# EAGLE design SilovaCastV2 (EAGLE 7.2.0)
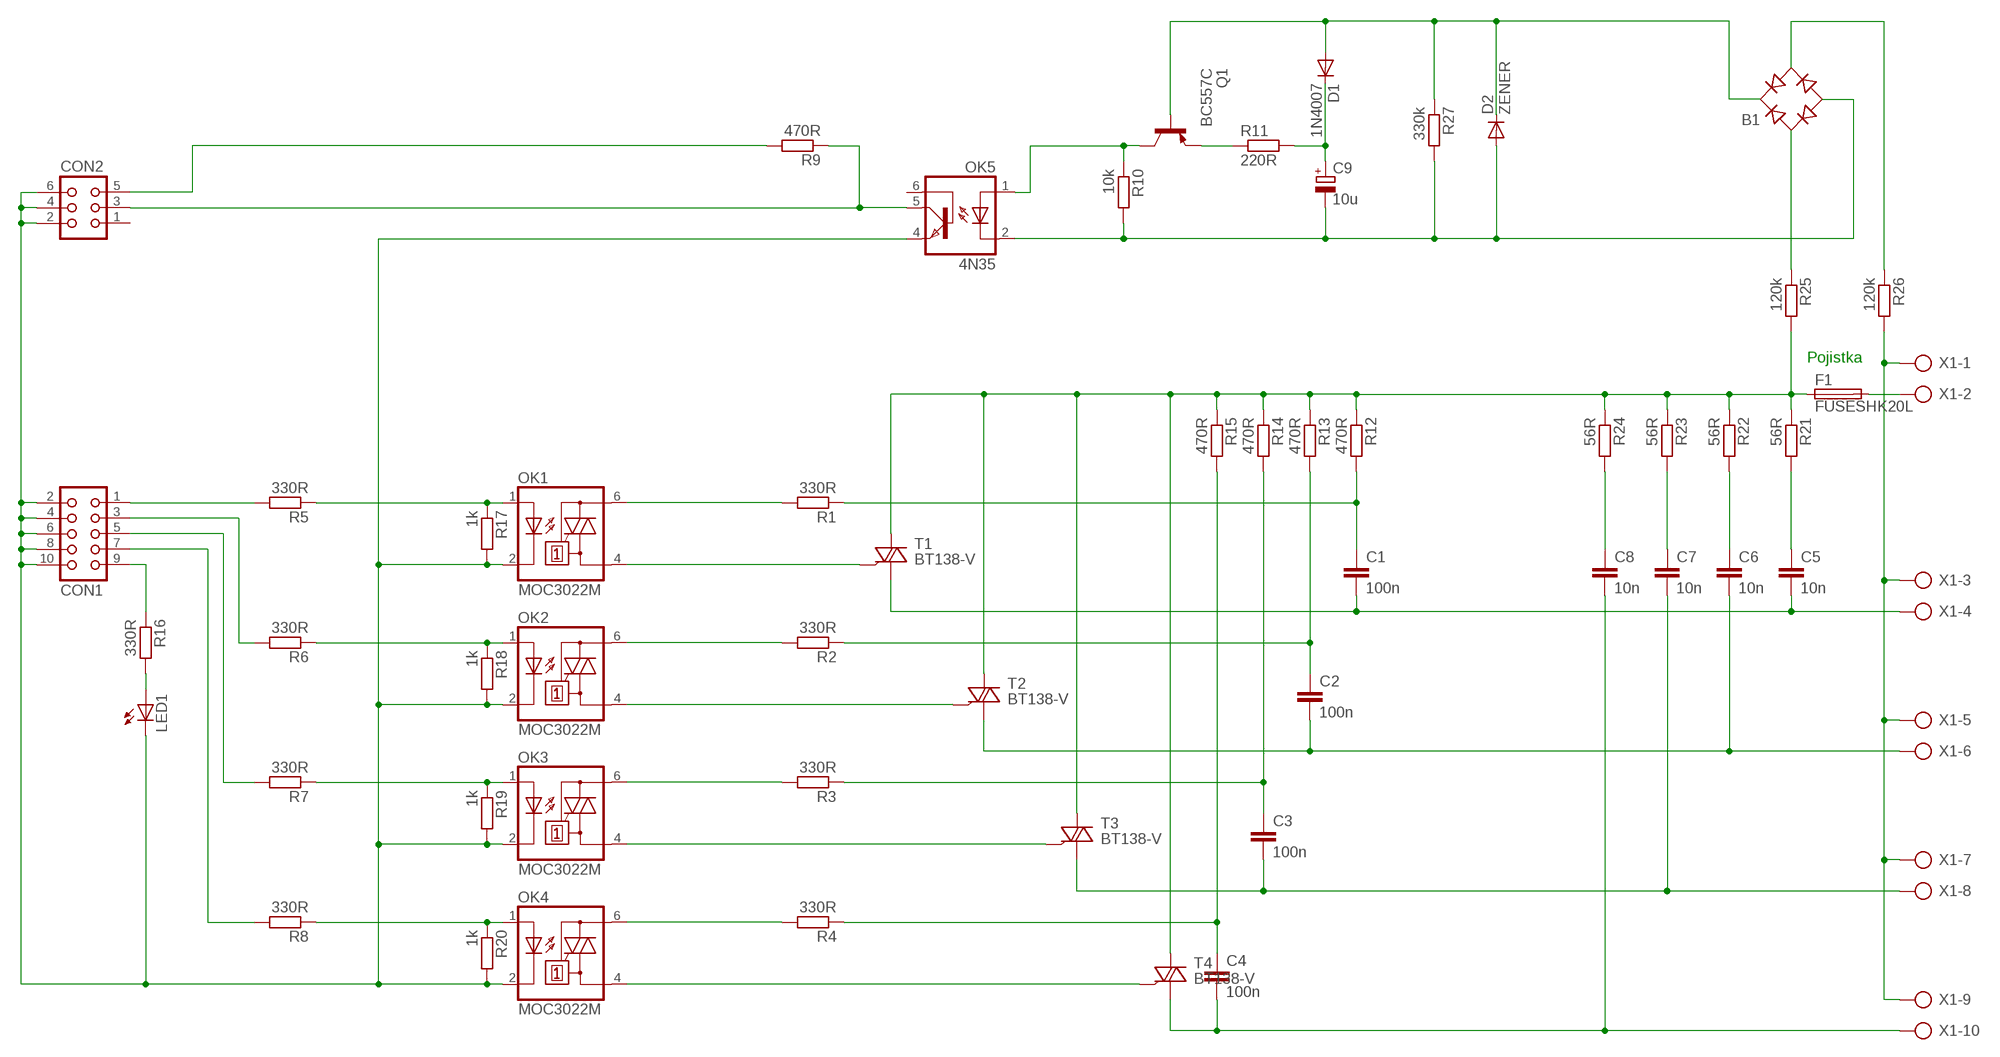
[diagram p0: schematic, sheet 1]

## Parts
B1  RB1A  [RB1A]
C1  100n  C7.5/6  [C7.5B6]
C2  100n  C7.5/6  [C7.5B6]
C3  100n  C7.5/6  [C7.5B6]
C4  100n  C7.5/6  [C7.5B6]
C5  10n  C7.5/6  [C7.5B6]
C6  10n  C7.5/6  [C7.5B6]
C7  10n  C7.5/6  [C7.5B6]
C8  10n  C7.5/6  [C7.5B6]
C9  10u  CPOL-EUE3.5-8  [E3,5-8]
CON1  CON10  [CON10]
CON2  CON06  [CON06]
D1  1N4007  1N4004  [DO41-10]
D2  ZENER  1N4004  [DO41-10]
F1  FUSESHK20L  [SHK20L]
LED1  LED5MM  [LED5MM]
OK1  MOC3022M  [DIL06]
OK2  MOC3022M  [DIL06]
OK3  MOC3022M  [DIL06]
OK4  MOC3022M  [DIL06]
OK5  4N35  [DIL06]
Q1  BC557C  [TO92-EBC]
R1  330R  R-EU_0207/12  [0207/12]
R2  330R  R-EU_0207/12  [0207/12]
R3  330R  R-EU_0207/12  [0207/12]
R4  330R  R-EU_0207/12  [0207/12]
R5  330R  R-EU_R0805  [R0805]
R6  330R  R-EU_R0805  [R0805]
R7  330R  R-EU_R0805  [R0805]
R8  330R  R-EU_R0805  [R0805]
R9  470R  R-EU_0207/12  [0207/12]
R10  10k  R-EU_R0805  [R0805]
R11  220R  R-EU_0207/12  [0207/12]
R12  470R  R-EU_0207/12  [0207/12]
R13  470R  R-EU_0207/12  [0207/12]
R14  470R  R-EU_0207/12  [0207/12]
R15  470R  R-EU_0207/12  [0207/12]
R16  330R  R-EU_0207/12  [0207/12]
R17  1k  R-EU_R0805  [R0805]
R18  1k  R-EU_R0805  [R0805]
R19  1k  R-EU_R0805  [R0805]
R20  1k  R-EU_R0805  [R0805]
R21  56R  R-EU_0411/15  [0411/15]
R22  56R  R-EU_0411/15  [0411/15]
R23  56R  R-EU_0411/15  [0411/15]
R24  56R  R-EU_0411/15  [0411/15]
R25  120k  R-EU_0207/12  [0207/12]
R26  120k  R-EU_0207/12  [0207/12]
R27  330k  R-EU_0207/12  [0207/12]
T1  BT138-V  [TO220BV]
T2  BT138-V  [TO220BV]
T3  BT138-V  [TO220BV]
T4  BT138-V  [TO220BV]
X1  AK300/10  [AK300/10]

## Nets
GND: CON1.2 CON1.4 CON1.6 CON1.8 CON1.10 CON2.2 CON2.4 CON2.6 LED1.K(C) OK1.2(C) OK2.2(C) OK3.2(C) OK4.2(C) OK5.4(EMI) R17.2 R18.2 R19.2 R20.2
L: F1.1A R12.1 R13.1 R14.1 R15.1 R21.1 R22.1 R23.1 R24.1 R25.2 T1.T2(A2) T2.T2(A2) T3.T2(A2) T4.T2(A2)
N$1: C3.2 C7.2 T3.T1(A1) X1.8
N$2: C4.2 C8.2 T4.T1(A1) X1.10
N$3: C2.2 C6.2 T2.T1(A1) X1.6
N$4: OK3.4(A1) T3.G
N$5: OK4.4(A1) T4.G
N$6: OK2.4(A1) T2.G
N$7: OK1.4(A1) T1.G
N$8: C1.2 C5.2 T1.T1(A1) X1.4
N$9: OK1.6(A2) R1.2
N$10: OK2.6(A2) R2.2
N$11: OK3.6(A2) R3.2
N$12: OK4.6(A2) R4.2
N$13: C9.+ D1.C R11.2
N$14: B1.+ D1.A D2.C Q1.B R27.1
N$15: B1.- C9.- D2.A OK5.2(C) R10.2 R27.2
N$16: F1.2A X1.2
N$17: CON2.5 R9.2
N$18: OK5.1(A) Q1.C R10.1
N$19: Q1.E R11.1
N$20: C2.1 R2.1 R13.2
N$21: C3.1 R3.1 R14.2
N$22: CON2.3 OK5.5(COL) R9.1
N$23: CON1.1 R5.2
N$24: OK1.1(A) R5.1 R17.1
N$25: OK2.1(A) R6.1 R18.1
N$26: OK3.1(A) R7.1 R19.1
N$27: OK4.1(A) R8.1 R20.1
N$28: CON1.3 R6.2
N$29: CON1.5 R7.2
N$30: CON1.7 R8.2
N$31: CON1.9 R16.1
N$32: C4.1 R4.1 R15.2
N$33: C1.1 R1.1 R12.2
N$34: LED1.A R16.2
N$36: C5.1 R21.2
N$37: C6.1 R22.2
N$38: C7.1 R23.2
N$39: C8.1 R24.2
N$40: B1.AC2 R26.1
N$41: B1.AC1 R25.1
N_PEN: R26.2 X1.1 X1.3 X1.5 X1.7 X1.9
Unconnected: CON2.1 OK5.6(BAS)

## Notes on the sheet
- Pojistka

## Library data of the parts
B1 = rectifier:RB1A: RECTIFIER 1 A
C1-C8 = capacitor-wima:C: CAPACITOR naming: grid - package width
C9 = rcl:CPOL-EU: POLARIZED CAPACITOR, European symbol
CON1 = con-harting:CON10: CONNECTOR; OC_FARNELL: unknown; OC_NEWARK: unknown
CON2 = con-harting:CON06: CONNECTOR; OC_FARNELL: unknown; OC_NEWARK: unknown
D1 D2 = diode:1N4004: DIODE general purpose rectifier, 1 A
F1 = fuse:FUSE: Fuse; OC_FARNELL: unknown; OC_NEWARK: unknown
LED1 = led:LED: LED OSRAM: - CHIPLED LG R971, LG N971, LY N971, LG Q971, LY Q971, LO R971, LY R971 LH N974, LH R974 LS Q976, LO Q976, LY Q976 LO Q996 - Hyper CHIPLED LW Q18S LB Q993, LB Q99A, LB R99A - SideLED LS A670, LO A670, LY A670, LG A670, LP A670 LB A673, LV A673, LT A673, LW A673 LH A674 LY A675 LS A676, LA A676, LO A676, LY A676, LW A676 LS A679, LY A679, LG A679 - Hyper Micro SIDELED® LS Y876, LA Y876, LO Y876, LY Y876 LT Y87S - SmartLED LW L88C, LW L88S LB L89C, LB L89S, LG L890 LS L89K, LO L89K, LY L89K LS L896, LA L896, LO L896, LY L896 - TOPLED LS T670, LO T670, LY T670, LG T670, LP T670 LSG T670, LSP T670, LSY T670, LOP T670, LYG T670 LG T671, LOG T671, LSG T671 LB T673, LV T673, LT T673, LW T673 LH T674 LS T676, LA T676, LO T676, LY T676, LB T676, LH T676, LSB T676, LW T676 LB T67C, LV T67C, LT T67C, LS T67K, LO T67K, LY T67K, LW E67C LS E67B, LA E67B, LO E67B, LY E67B, LB E67C, LV E67C, LT E67C LW T67C LS T679, LY T679, LG T679 LS T770, LO T770, LY T770, LG T770, LP T770 LB T773, LV T773, LT T773, LW T773 LH T774 LS E675, LA E675, LY E675, LS T675 LS T776, LA T776, LO T776, LY T776, LB T776 LHGB T686 LT T68C, LB T68C - Hyper Mini TOPLED® LB M676 - Mini TOPLED Santana® LG M470 LS M47K, LO M47K, LY M47K Source: http://www.osram.convergy.de LUXEON: - LUMILED® LXK2-PW12-R00, LXK2-PW12-S00, LXK2-PW14-U00, LXK2-PW14-V00 LXK2-PM12-R00, LXK2-PM12-S00, LXK2-PM14-U00 LXK2-PE12-Q00, LXK2-PE12-R00, LXK2-PE12-S00, LXK2-PE14-T00, LXK2-PE14-U00 LXK2-PB12-K00, LXK2-PB12-L00, LXK2-PB12-M00, LXK2-PB14-N00, LXK2-PB14-P00, LXK2-PB14-Q00 LXK2-PR12-L00, LXK2-PR12-M00, LXK2-PR14-Q00, LXK2-PR14-R00 LXK2-PD12-Q00, LXK2-PD12-R00, LXK2-PD12-S00 LXK2-PH12-R00, LXK2-PH12-S00 LXK2-PL12-P00, LXK2-PL12-Q00, LXK2-PL12-R00 Source: www.luxeon.com KINGBRIGHT: KA-3528ASYC Source: www.kingbright.com
OK1-OK4 = optocoupler:MOC30*M: RANDOM-PHASE OPTOISOLATORS TRIAC DRIVER OUTPUT Source: http://www.fairchildsemi.com MOC3020-M.pdf; MF: FAIRCHILD SEMICONDUCTOR; MPN: MOC3022-M; OC_FARNELL: 1021086; OC_NEWARK: 58K1956
OK5 = optocoupler:4N35: MOTOROLA OPTO COUPLER; MF: FAIRCHILD SEMICONDUCTOR; MPN: 4N35; OC_FARNELL: 1328375; OC_NEWARK: 72K9946
Q1 = transistor-pnp:BC557*: PNP Transistror
R1-R27 = rcl:R-EU_: RESISTOR, European symbol
T1-T4 = triac:BT138: TRIAC Source: http://www.semiconductors.philips.com BT138_SERIES_2.pdf
X1 = con-ptr500:AK300/10: CONNECTOR; OC_FARNELL: unknown; OC_NEWARK: unknown

## Board
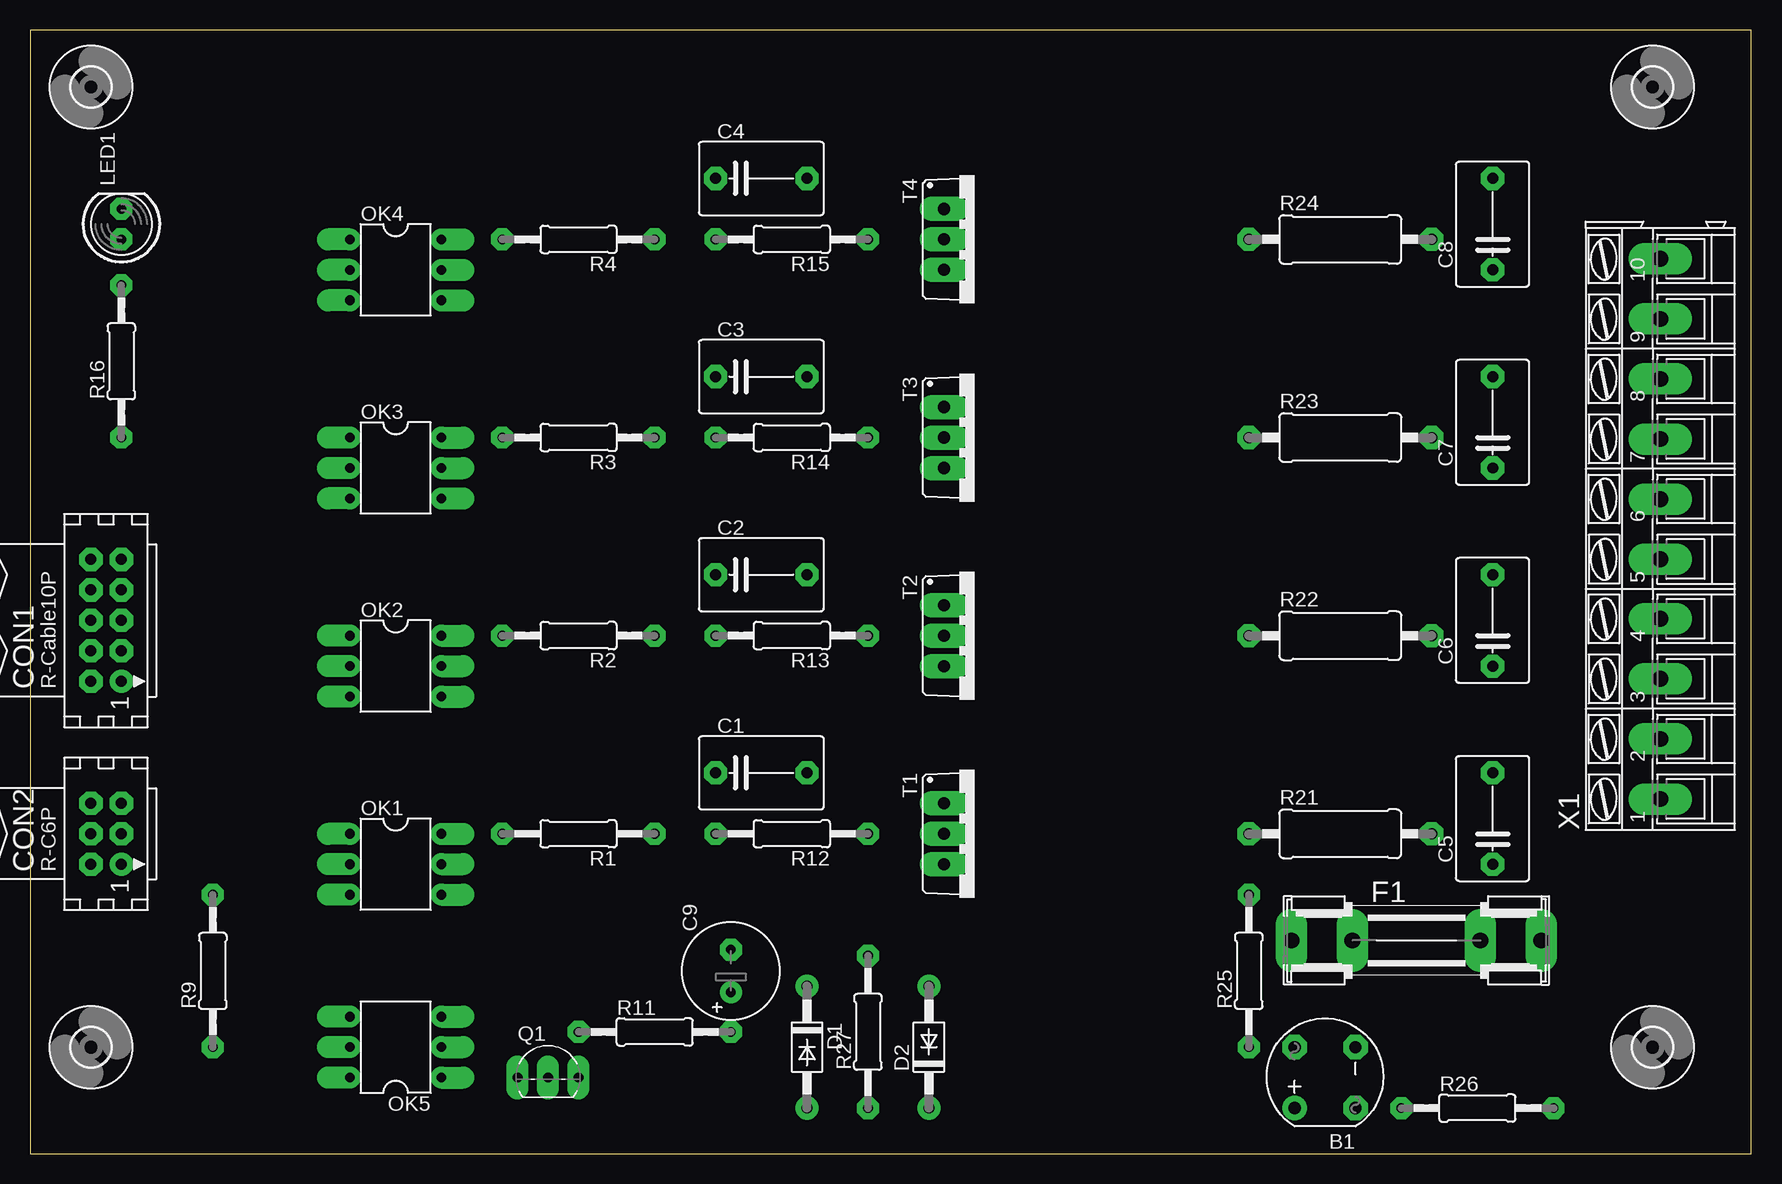
[diagram p1: board, top side]
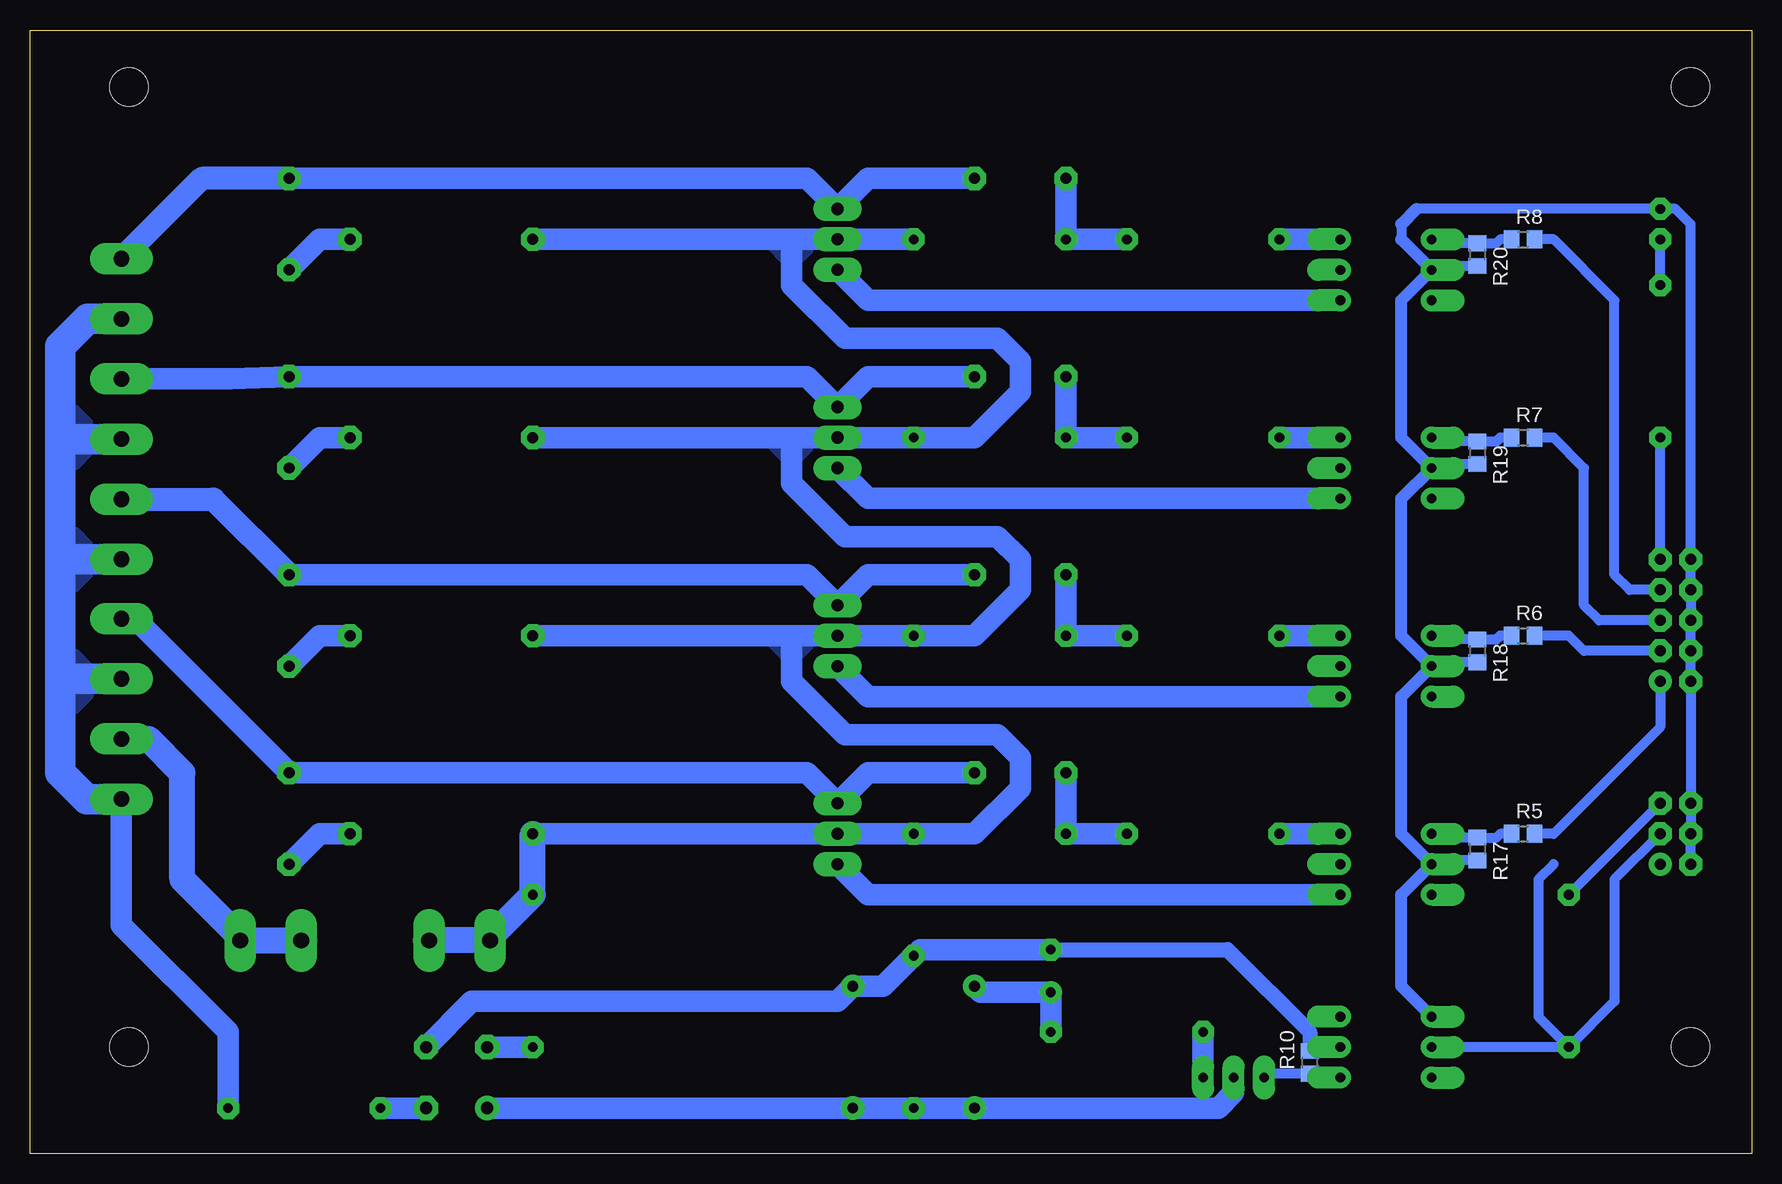
[diagram p2: board, bottom side, seen from below]

Size 143.49 x 93.65 mm. Coordinates in mm from the lower left corner, seen from the top.
Outline: 0,0 143.49,0 143.49,93.65 0,93.65 0,0
Copper layers (1*16): Top 0.035mm / dielectric 1.5mm / Bottom 0.035mm
Design rules "default *": minimum track width 10mil, minimum drill 24mil, track to track 8mil, track to pad 8mil, pad to pad 8mil, via to via 8mil, smd to smd 8mil, copper to edge 40mil, drill to drill 8mil, minimum pad ring 20mil, minimum via ring 8mil, stop-mask expansion 4mil, vias tented up to drill 0mil, thermal gap 10mil

### Footprints (pad centres in the part's own frame; a part is rotated, then mirrored left to right if it is on the bottom)
RB1A = drill 1.016: + -2.54,2.54 | drill 1.016 octagon: - 2.54,-2.54; AC1 2.54,2.54; AC2 -2.54,-2.54
C7.5B6 = drill 0.914 pad 1.905 octagon: 1 -3.81,0; 2 3.81,0
E3,5-8 = drill 0.813 pad 1.6: + -1.778,0 | drill 0.813 pad 1.6 octagon: - 1.778,0
CON10 = drill 0.914: 1 -5.08,-1.27 | drill 0.914 octagon: 2 -5.08,1.27; 3 -2.54,-1.27; 4 -2.54,1.27; 5 0,-1.27; 6 0,1.27; 7 2.54,-1.27; 8 2.54,1.27; 9 5.08,-1.27; 10 5.08,1.27
CON06 = drill 0.914: 1 -2.54,-1.27 | drill 0.914 octagon: 2 -2.54,1.27; 3 0,-1.27; 4 0,1.27; 5 2.54,-1.27; 6 2.54,1.27
DO41-10 = drill 0.9 pad 1.93: A 5.08,0; C -5.08,0
SHK20L = drill 1.321 pad 2.54 long: 1A -10.414,0; 1B -5.334,0; 2A 10.414,0; 2B 5.334,0
LED5MM = drill 0.813 octagon: A -1.27,0; K 1.27,0
DIL06 = drill 0.813 offset: 1 -2.54,-3.81; 2 0,-3.81; 3 2.54,-3.81; 4 2.54,3.81; 5 0,3.81; 6 -2.54,3.81
TO92-EBC = drill 0.813 long: B 0,-1.27; C -2.54,-1.27; E 2.54,-1.27
0207/12 = drill 0.813 pad 1.676 octagon: 1 -6.35,0; 2 6.35,0
R0805 = smd 1.3 x 1.5: 1 -0.95,0; 2 0.95,0
0411/15 = drill 0.914 octagon: 1 -7.62,0; 2 7.62,0
TO220BV = drill 1.016 long: G 2.54,-2.54; T1 -2.54,-2.54; T2 0,-2.54
3,2 = hole 3.2: 0,0
AK300/10 = drill 1.321 long: 1 -22.504,0; 2 -17.501,0; 3 -12.497,0; 4 -7.493,0; 5 -2.515,0; 6 2.489,0; 7 7.493,0; 8 12.497,0; 9 17.501,0; 10 22.504,0

### Placement (x,y rotation side)
B1  107.95,6.35 90 top
C1  60.96,31.75 0 top
C2  60.96,48.26 0 top
C3  60.96,64.77 0 top
C4  60.96,81.28 0 top
C5  121.92,27.94 90 top
C6  121.92,44.45 90 top
C7  121.92,60.96 90 top
C8  121.92,77.47 90 top
C9  58.42,15.24 90 top
CON1  6.35,44.45 90 top
CON2  6.35,26.67 90 top
D1  64.77,8.89 270 top
D2  74.93,8.89 90 top
F1  115.57,17.78 0 top
LED1  7.62,77.47 90 top
OK1  30.48,24.13 270 top
OK2  30.48,40.64 270 top
OK3  30.48,57.15 270 top
OK4  30.48,73.66 270 top
OK5  30.48,8.89 90 top
Q1  43.18,7.62 0 top
R1  45.72,26.67 180 top
R2  45.72,43.18 180 top
R3  45.72,59.69 180 top
R4  45.72,76.2 180 top
R5  19.05,26.67 0 bottom
R6  19.05,43.18 0 bottom
R7  19.05,59.69 0 bottom
R8  19.05,76.2 0 bottom
R9  15.24,15.24 90 top
R10  36.83,7.62 90 bottom
R11  52.07,10.16 0 top
R12  63.5,26.67 180 top
R13  63.5,43.18 180 top
R14  63.5,59.69 180 top
R15  63.5,76.2 180 top
R16  7.62,66.04 90 top
R17  22.86,25.4 270 bottom
R18  22.86,41.91 270 bottom
R19  22.86,58.42 270 bottom
R20  22.86,74.93 270 bottom
R21  109.22,26.67 0 top
R22  109.22,43.18 0 top
R23  109.22,59.69 0 top
R24  109.22,76.2 0 top
R25  101.6,15.24 90 top
R26  120.65,3.81 0 top
R27  69.85,10.16 90 top
T1  78.74,26.67 270 top
T2  78.74,43.18 270 top
T3  78.74,59.69 270 top
T4  78.74,76.2 270 top
U$1  [3,2]  5.08,88.9 0 top
U$2  [3,2]  135.25,88.9 0 top
U$3  [3,2]  135.25,8.89 0 top
U$4  [3,2]  5.08,8.89 0 top
X1  135.89,52.07 90 top

### Tracks (layer width: path | path; a pad name or v marks a point on that pad's centre or on a via)
GND
  Bottom 0.813: R17.2 26.35,24.45 OK1.2 | R18.2 26.35,40.96 OK2.2 | R19.2 26.35,57.47 OK3.2 | R20.2 26.35,73.98 OK4.2 | 29.21,77.47 29.21,76.2 | CON2.2 CON2.4 CON2.6 CON1.2 CON1.4 CON1.6 CON1.8 CON1.10 5.08,77.47 6.35,78.74 LED1.K 27.94,78.74
  Bottom 1.016: OK5.4 29.21,13.97 29.21,21.59 OK1.2 29.21,26.67 29.21,38.1 OK2.2 29.21,43.18 29.21,54.61 OK3.2 29.21,59.69 29.21,71.12 OK4.2 29.21,76.2 | 27.94,78.74 29.21,77.47
L
  Bottom 1.778: 80.01,76.2 T4.T2 R15.1 | 80.01,76.2 R24.1 | 80.01,59.69 T3.T2 R14.1 64.77,59.69 60.96,63.5 60.96,66.04 62.87,67.94 75.56,67.94 80.01,72.39 80.01,76.2 | 80.01,59.69 R23.1 | 80.01,43.18 T2.T2 R13.1 64.77,43.18 60.96,46.99 60.96,49.53 62.87,51.44 75.56,51.44 80.01,55.88 80.01,59.69 | 80.01,43.18 R22.1 | R21.1 T1.T2 R12.1 64.77,26.67 60.96,30.48 60.96,33.02 62.87,34.92 75.56,34.92 80.01,39.37 80.01,43.18 | F1.1A 105.16,18.03
  Bottom 2.184: 105.16,18.03 R25.2 R21.1
  pour Bottom: 80.01,40.64 82.55,43.18 77.47,43.18
  pour Bottom: 80.01,57.15 82.55,59.69 77.47,59.69
  pour Bottom: 80.01,73.66 82.55,76.2 77.47,76.2
N$1
  Bottom 1.778: C3.2 73.66,64.77 T3.T1 78.74,64.77 C7.2 126.8,64.57 X1.8
N$2
  Bottom 1.778: C4.2 73.66,81.28 T4.T1 78.74,81.28 C8.2 | 135.53,74.93 X1.10
  Bottom 1.93: C8.2 129.18,81.28 X1.10
N$3
  Bottom 1.778: C2.2 73.66,48.26 T2.T1 78.74,48.26 C6.2
  Bottom 1.93: X1.6 128.22,54.56 C6.2
N$4
  Bottom 1.778: OK3.4 73.66,54.61 T3.G
N$5
  Bottom 1.778: OK4.4 73.66,71.12 T4.G
N$6
  Bottom 1.778: OK2.4 73.66,38.1 T2.G
N$7
  Bottom 1.778: OK1.4 73.66,21.59 T1.G
N$8
  Bottom 1.778: C1.2 73.66,31.75 T1.T1 78.74,31.75 C5.2 134.75,44.58 X1.4
N$9
  Bottom 1.778: OK1.6 R1.2
N$10
  Bottom 1.778: OK2.6 R2.2
N$11
  Bottom 1.778: OK3.6 R3.2
N$12
  Bottom 1.778: OK4.6 R4.2
N$13
  Bottom 1.778: D1.C 64.26,13.46 C9.+ R11.2
N$14
  Bottom 1.778: B1.+ D2.C R27.1 D1.A 44.45,3.81 43.18,5.08 Q1.B
N$15
  Bottom 0.813: R10.2 34.61,8.57 OK5.2
  Bottom 1.27: C9.- 43.69,17.02 36.83,10.16 R10.2
  Bottom 1.778: B1.- 106.68,12.7 76.2,12.7 D2.A 72.39,13.97 R27.2 69.34,17.02 C9.-
N$16
  Bottom 2.184: F1.2A 125.98,18.03 130.81,22.86 130.81,31.75 133.63,34.57 X1.2
N$17
  Bottom 0.813: CON2.5 R9.2
N$18
  Bottom 0.813: OK5.1 34.61,6.67 R10.1 40.32,6.67 Q1.C
N$19
  Bottom 1.778: R11.1 Q1.E
N$20
  Bottom 1.778: R2.1 R13.2 C2.1
N$21
  Bottom 1.778: R3.1 R14.2 C3.1
N$22
  Bottom 0.813: R9.1 OK5.5 | 16.51,24.13 17.78,22.86 17.78,11.43 R9.1 | CON2.3 11.43,22.86 11.43,12.7 R9.1
N$23
  Bottom 0.813: CON1.1 7.62,35.56 16.51,26.67 R5.2
N$24
  Bottom 0.813: OK1.1 26.35,26.35 R17.1 21.27,26.35 20.95,26.67 R5.1
N$25
  Bottom 0.813: OK2.1 26.35,42.86 R18.1 21.27,42.86 20.95,43.18 R6.1
N$26
  Bottom 0.813: OK3.1 26.35,59.37 R19.1 21.27,59.37 20.95,59.69 R7.1
N$27
  Bottom 0.813: OK4.1 26.35,75.88 R20.1 21.27,75.88 20.95,76.2 R8.1
N$28
  Bottom 0.813: CON1.3 13.97,41.91 15.24,43.18 R6.2
N$29
  Bottom 0.813: CON1.5 12.7,44.45 13.97,45.72 13.97,57.15 16.51,59.69 R7.2
N$30
  Bottom 0.813: CON1.7 10.16,46.99 11.43,48.26 11.43,71.12 16.51,76.2 R8.2
N$31
  Bottom 0.813: CON1.9 R16.1
N$32
  Bottom 1.778: R4.1 R15.2 C4.1
N$33
  Bottom 1.778: R1.1 R12.2 C1.1
N$34
  Bottom 0.813: R16.2 LED1.A
N$36
  Bottom 1.778: R21.2 119.38,26.67 C5.1
N$37
  Bottom 1.778: R22.2 119.38,43.18 C6.1
N$38
  Bottom 1.778: R23.2 119.38,59.69 C7.1
N$39
  Bottom 1.778: R24.2 119.38,76.2 C8.1
N$40
  Bottom 1.778: B1.AC2 R26.1
N$41
  Bottom 1.778: B1.AC1 R25.1
N$42
  Bottom 2.184: 105.41,17.78 110.49,17.78
N$43
  Bottom 2.184: 125.73,17.78 120.65,17.78
N_PEN
  Bottom 1.778: X1.1 135.89,19.05 127,10.16 R26.2 | 139.57,59.56 140.97,59.69 | 139.68,49.55 140.97,49.53 | 139.5,39.57 140.97,39.37
  Bottom 2.54: X1.1 138.79,29.57 140.97,31.75 140.97,39.37 140.97,49.53 140.97,59.69 140.97,67.31 138.71,69.57 X1.9 | X1.7 139.57,59.56 | X1.5 139.68,49.55 | X1.3 139.5,39.57
  pour Bottom: 138.43,60.96 138.43,58.42 139.7,57.15 140.97,57.15 140.97,62.23 139.7,62.23
  pour Bottom: 138.43,50.8 138.43,48.26 139.7,46.99 140.97,46.99 140.97,52.07 139.7,52.07
  pour Bottom: 138.43,40.64 138.43,38.1 139.7,36.83 140.97,36.83 140.97,41.91 139.7,41.91